# EAGLE schematic Ruggeduino (EAGLE 7.6.0)

## Sheet 1 of 4
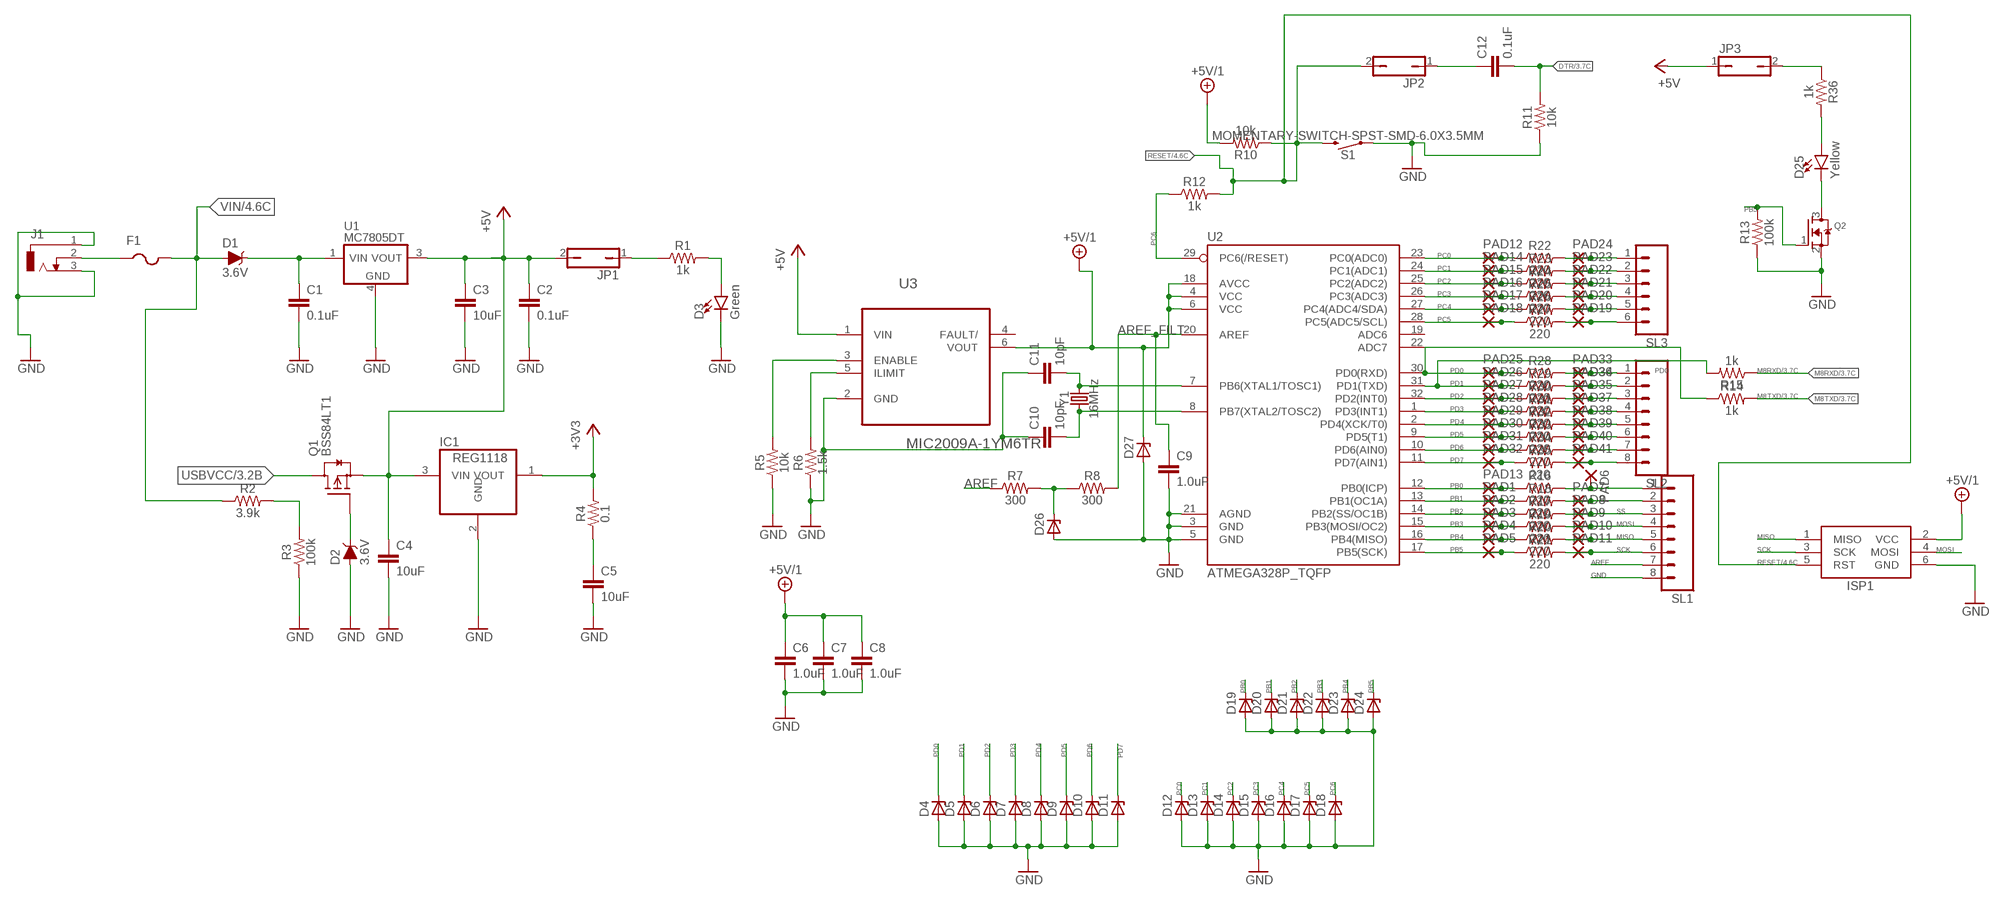
[diagram p0: schematic, sheet 1]

### Parts
C1  0.1uF  0.1UF-0603-25V-(+80/-20%)  [0603]
C2  0.1uF  0.1UF-0603-25V-(+80/-20%)  [0603]
C3  10uF  10UF-0603-6.3V-20%  [0603]
C4  10uF  10UF-0603-6.3V-20%  [0603]
C5  10uF  10UF-0603-6.3V-20%  [0603]
C6  1.0uF  1.0UF-0603-16V-10%  [0603]
C7  1.0uF  1.0UF-0603-16V-10%  [0603]
C8  1.0uF  1.0UF-0603-16V-10%  [0603]
C9  1.0uF  1.0UF-0603-16V-10%  [0603]
C10  10pF  10PF-0603-50V-5%  [0603]
C11  10pF  10PF-0603-50V-5%  [0603]
C12  0.1uF  0.1UF-0603-25V-(+80/-20%)  [0603]
D1  3.6V  DIODE-ZENER-BZT52C3V6S  [SOD-323]
D2  3.6V  DIODE-ZENER-BZT52C3V6S  [SOD-323]
D3  Green  LED-GREEN1206-BOTTOM  [LED-1206-BOTTOM]
D4  ZENER-DIODESOT23  [SOT23]
D5  ZENER-DIODESOT23  [SOT23]
D6  ZENER-DIODESOT23  [SOT23]
D7  ZENER-DIODESOT23  [SOT23]
D8  ZENER-DIODESOT23  [SOT23]
D9  ZENER-DIODESOT23  [SOT23]
D10  ZENER-DIODESOT23  [SOT23]
D11  ZENER-DIODESOT23  [SOT23]
D12  ZENER-DIODESOT23  [SOT23]
D13  ZENER-DIODESOT23  [SOT23]
D14  ZENER-DIODESOT23  [SOT23]
D15  ZENER-DIODESOT23  [SOT23]
D16  ZENER-DIODESOT23  [SOT23]
D17  ZENER-DIODESOT23  [SOT23]
D18  ZENER-DIODESOT23  [SOT23]
D19  ZENER-DIODESOT23  [SOT23]
D20  ZENER-DIODESOT23  [SOT23]
D21  ZENER-DIODESOT23  [SOT23]
D22  ZENER-DIODESOT23  [SOT23]
D23  ZENER-DIODESOT23  [SOT23]
D24  ZENER-DIODESOT23  [SOT23]
D25  Yellow  LED-YELLOW0603  [LED-0603]
D26  ZENER-DIODESOT23  [SOT23]
D27  ZENER-DIODESOT23  [SOT23]
F1  PTCFUSE-1206  [R1206]
IC1  REG1118  [SOT223]
ISP1  AVRISP-6  [AVRISP]
J1  DCJ0303  [DCJ0303]
JP1  JP1Q  [JP1]
JP2  JP1Q  [JP1]
JP3  JP1Q  [JP1]
PAD1  1,6/0,8  [1,6/0,8]
PAD2  1,6/0,8  [1,6/0,8]
PAD3  1,6/0,8  [1,6/0,8]
PAD4  1,6/0,8  [1,6/0,8]
PAD5  1,6/0,8  [1,6/0,8]
PAD6  1,6/0,8  [1,6/0,8]
PAD7  1,6/0,8  [1,6/0,8]
PAD8  1,6/0,8  [1,6/0,8]
PAD9  1,6/0,8  [1,6/0,8]
PAD10  1,6/0,8  [1,6/0,8]
PAD11  1,6/0,8  [1,6/0,8]
PAD12  1,6/0,8  [1,6/0,8]
PAD13  1,6/0,8  [1,6/0,8]
PAD14  1,6/0,8  [1,6/0,8]
PAD15  1,6/0,8  [1,6/0,8]
PAD16  1,6/0,8  [1,6/0,8]
PAD17  1,6/0,8  [1,6/0,8]
PAD18  1,6/0,8  [1,6/0,8]
PAD19  1,6/0,8  [1,6/0,8]
PAD20  1,6/0,8  [1,6/0,8]
PAD21  1,6/0,8  [1,6/0,8]
PAD22  1,6/0,8  [1,6/0,8]
PAD23  1,6/0,8  [1,6/0,8]
PAD24  1,6/0,8  [1,6/0,8]
PAD25  1,6/0,8  [1,6/0,8]
PAD26  1,6/0,8  [1,6/0,8]
PAD27  1,6/0,8  [1,6/0,8]
PAD28  1,6/0,8  [1,6/0,8]
PAD29  1,6/0,8  [1,6/0,8]
PAD30  1,6/0,8  [1,6/0,8]
PAD31  1,6/0,8  [1,6/0,8]
PAD32  1,6/0,8  [1,6/0,8]
PAD33  1,6/0,8  [1,6/0,8]
PAD34  1,6/0,8  [1,6/0,8]
PAD35  1,6/0,8  [1,6/0,8]
PAD36  1,6/0,8  [1,6/0,8]
PAD37  1,6/0,8  [1,6/0,8]
PAD38  1,6/0,8  [1,6/0,8]
PAD39  1,6/0,8  [1,6/0,8]
PAD40  1,6/0,8  [1,6/0,8]
PAD41  1,6/0,8  [1,6/0,8]
Q1  BSS84LT1  [SOT23]
Q2  MOSFET-NREFLOW  [SOT23]
R1  1k  1KOHM-0603-1/10W-1%  [0603]
R2  3.9k  3.9KOHM-0603-1/10W-1%  [0603]
R3  100k  100KOHM-0603-1/10W-1%  [0603]
R4  0.1  0.1OHM-1210-1/2W-1%  [1210]
R5  10k  10KOHM-0603-1/10W-1%  [0603]
R6  1.5k  1.5KOHM-0603-1/10W-1%  [0603]
R7  300  300OHM-0603-1/10W-1%  [0603]
R8  300  300OHM-0603-1/10W-1%  [0603]
R10  10k  10KOHM-0603-1/10W-1%  [0603]
R11  10k  10KOHM-0603-1/10W-1%  [0603]
R12  1k  1KOHM-0603-1/10W-1%  [0603]
R13  100k  100KOHM-0603-1/10W-1%  [0603]
R14  1k  1KOHM-0603-1/10W-1%  [0603]
R15  1k  1KOHM-0603-1/10W-1%  [0603]
R16  220  220OHM-0603-1/10W-1%  [0603]
R17  220  220OHM-0603-1/10W-1%  [0603]
R18  220  220OHM-0603-1/10W-1%  [0603]
R19  220  220OHM-0603-1/10W-1%  [0603]
R20  220  220OHM-0603-1/10W-1%  [0603]
R21  220  220OHM-0603-1/10W-1%  [0603]
R22  220  220OHM-0603-1/10W-1%  [0603]
R23  220  220OHM-0603-1/10W-1%  [0603]
R24  220  220OHM-0603-1/10W-1%  [0603]
R25  220  220OHM-0603-1/10W-1%  [0603]
R26  220  220OHM-0603-1/10W-1%  [0603]
R27  220  220OHM-0603-1/10W-1%  [0603]
R28  220  220OHM-0603-1/10W-1%  [0603]
R29  220  220OHM-0603-1/10W-1%  [0603]
R30  220  220OHM-0603-1/10W-1%  [0603]
R31  220  220OHM-0603-1/10W-1%  [0603]
R32  220  220OHM-0603-1/10W-1%  [0603]
R33  220  220OHM-0603-1/10W-1%  [0603]
R34  220  220OHM-0603-1/10W-1%  [0603]
R35  220  220OHM-0603-1/10W-1%  [0603]
R36  1k  1KOHM-0603-1/10W-1%  [0603]
S1  MOMENTARY-SWITCH-SPST-SMD-6.0X3.5MM  [TACTILE_SWITCH_SMD_6.0X3.5MM]
SL1  MA08  [08PA]
SL2  MA08  [08PA]
SL3  MA06  [06PA]
U1  MC7805DT  [DPAK-3]
U2  ATMEGA328P_TQFP  [TQFP32-08]
U3  MIC2009A-1YM6TR  [SOT95P280X145-6N]
Y1  16MHz  CRYSTAL-16MHZSMD-5X3.2  [CRYSTAL-SMD-5X3.2-4PAD]

### Nets
+3V3: IC1.1(VOUT) R4.2
+5V: C2.1 C3.1 C4.1 IC1.3(VIN) JP1.2 JP3.1 Q1.2(S) U1.3(VOUT) U3.1(VIN)
+5V/1: C6.1 C7.1 C8.1 D27.3(C) ISP1.2(VCC) R10.2 U2.4(VCC) U2.6(VCC) U2.18(AVCC) U3.6(VOUT)
AREF: R7.1 SL1.7
AREF_FILT: C9.1 R8.2 U2.20(AREF)
D0: PAD41.1(P) R35.2 SL2.8
DTR/3.7C: C12.2 R11.2
GND: C1.2 C2.2 C3.2 C4.2 C5.2 C6.2 C7.2 C8.2 C9.2 C10.1 C11.1 D2.A D3.C D4.1(A) D5.1(A) D6.1(A) D7.1(A) D8.1(A) D9.1(A) D10.1(A) D11.1(A) D12.1(A) D13.1(A) D14.1(A) D15.1(A) D16.1(A) D17.1(A) D18.1(A) D19.1(A) D20.1(A) D21.1(A) D22.1(A) D23.1(A) D24.1(A) D26.1(A) D27.1(A) IC1.2(GND) ISP1.6(GND) J1.1 J1.3 Q2.2(S) R3.1 R5.1 R6.1 R11.1 R13.1 S1.1 SL1.8 U1.4(GND) U2.3(GND) U2.5(GND) U2.21(AGND) U3.2(GND)
M8RXD/3.7C: R15.1
M8TXD/3.7C: R14.2
MISO: ISP1.1(MISO) PAD10.1(P) R20.2 SL1.5
MOSI: ISP1.4(MOSI) PAD9.1(P) R19.2 SL1.4
N$1: C5.1 R4.1
N$3: F1.1 J1.2
N$4: R6.2 U3.5(ILIMIT)
N$5: C1.1 D1.C U1.1(VIN)
N$6: JP1.1 R1.1
N$7: D3.A R1.2
N$8: R2.2 R3.2
N$9: R5.2 U3.3(ENABLE)
N$10: D2.C Q1.1(G)
N$11: C11.2 U2.7(PB6(XTAL1/TOSC1)) Y1.3
N$12: D26.3(C) R7.2 R8.1
N$13: C12.1 JP2.1
N$14: C10.2 U2.8(PB7(XTAL2/TOSC2)) Y1.1
N$15: JP3.2 R36.1
N$16: D25.A R36.2
N$17: D25.C Q2.3(D)
N$25: PAD6.1(P) R16.2 SL1.1
N$26: PAD7.1(P) R18.2 SL1.2
N$31: PAD24.1(P) R22.2 SL3.1
N$32: PAD23.1(P) R23.2 SL3.2
N$33: PAD22.1(P) R24.2 SL3.3
N$34: PAD21.1(P) R25.2 SL3.4
N$35: PAD20.1(P) R26.2 SL3.5
N$36: PAD19.1(P) R27.2 SL3.6
N$37: PAD34.1(P) PAD36.1(P) R29.2 SL2.2
N$47: PAD35.1(P) R30.2 SL2.3
N$48: PAD37.1(P) R31.2 SL2.4
N$49: PAD38.1(P) R32.2 SL2.5
N$50: PAD39.1(P) R33.2 SL2.6
N$51: PAD40.1(P) R34.2 SL2.7
PB0: D19.3(C) PAD13.1(P) R16.1 U2.12(PB0(ICP))
PB1: D20.3(C) PAD1.1(P) R18.1 U2.13(PB1(OC1A))
PB2: D21.3(C) PAD2.1(P) R17.1 U2.14(PB2(SS/OC1B))
PB3: D22.3(C) PAD3.1(P) R19.1 U2.15(PB3(MOSI/OC2))
PB4: D23.3(C) PAD4.1(P) R20.1 U2.16(PB4(MISO))
PB5: D24.3(C) PAD5.1(P) Q2.1(G) R13.2 R21.1 U2.17(PB5(SCK))
PC0: D12.3(C) PAD12.1(P) R22.1 U2.23(PC0(ADC0))
PC1: D13.3(C) PAD14.1(P) R23.1 U2.24(PC1(ADC1))
PC2: D14.3(C) PAD15.1(P) R24.1 U2.25(PC2(ADC2))
PC3: D15.3(C) PAD16.1(P) R25.1 U2.26(PC3(ADC3))
PC4: D16.3(C) PAD17.1(P) R26.1 U2.27(PC4(ADC4/SDA))
PC5: D17.3(C) PAD18.1(P) R27.1 U2.28(PC5(ADC5/SCL))
PC6: D18.3(C) R12.1 U2.29(PC6(/RESET))
PD0: D4.3(C) PAD25.1(P) PAD33.1(P) R14.1 R28.1 R28.2 SL2.1 U2.30(PD0(RXD))
PD1: D5.3(C) PAD26.1(P) R15.2 R29.1 U2.31(PD1(TXD))
PD2: D6.3(C) PAD27.1(P) R30.1 U2.32(PD2(INT0))
PD3: D7.3(C) PAD28.1(P) R31.1 U2.1(PD3(INT1))
PD4: D8.3(C) PAD29.1(P) R32.1 U2.2(PD4(XCK/T0))
PD5: D9.3(C) PAD30.1(P) R33.1 U2.9(PD5(T1))
PD6: D10.3(C) PAD31.1(P) R34.1 U2.10(PD6(AIN0))
PD7: D11.3(C) PAD32.1(P) R35.1 U2.11(PD7(AIN1))
RESET/4.6C: ISP1.5(RST) JP2.2 R10.1 R12.2 S1.2
SCK: ISP1.3(SCK) PAD11.1(P) R21.2 SL1.6
SS: PAD8.1(P) R17.2 SL1.3
USBVCC/3.2B: Q1.3(D)
VIN/4.6C: D1.A F1.2 R2.1
Unconnected: U2.19(ADC6) U2.22(ADC7) U3.4(FAULT/)

## Sheet 2 of 4
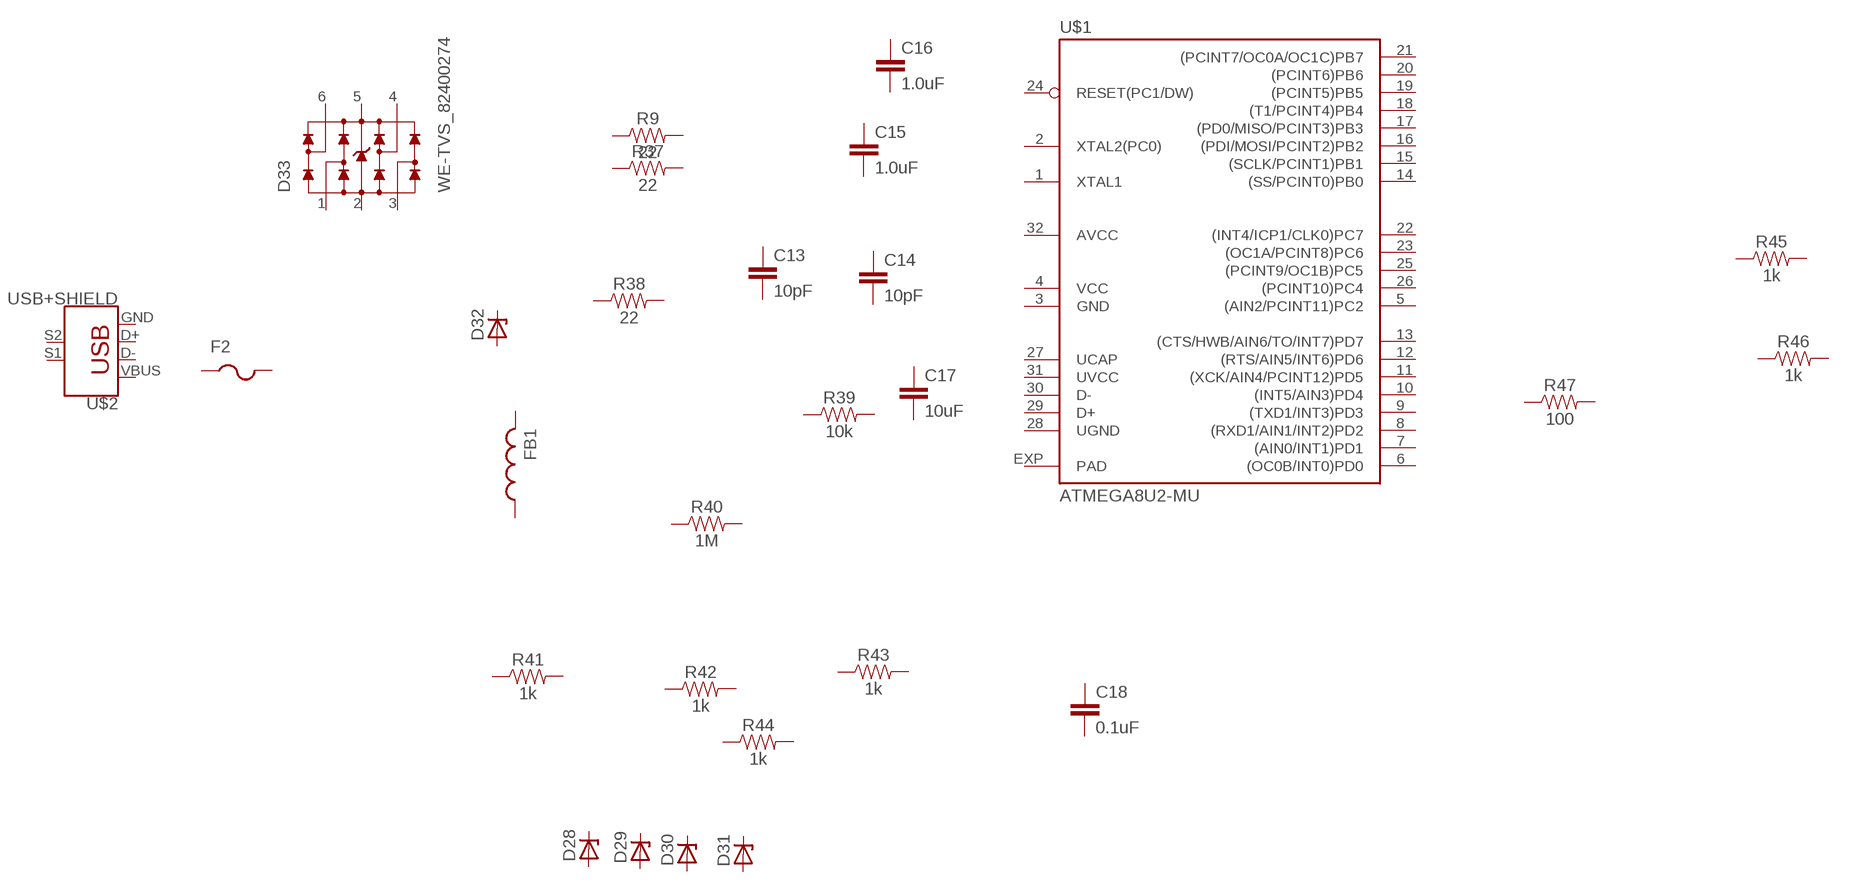
[diagram p1: schematic, sheet 2]

### Parts
C13  10pF  10PF-0603-50V-5%  [0603]
C14  10pF  10PF-0603-50V-5%  [0603]
C15  1.0uF  1.0UF-0603-16V-10%  [0603]
C16  1.0uF  1.0UF-0603-16V-10%  [0603]
C17  10uF  10UF-0603-6.3V-20%  [0603]
C18  0.1uF  0.1UF-0603-25V-(+80/-20%)  [0603]
D28  ZENER-DIODESOT23  [SOT23]
D29  ZENER-DIODESOT23  [SOT23]
D30  ZENER-DIODESOT23  [SOT23]
D31  ZENER-DIODESOT23  [SOT23]
D32  ZENER-DIODESOT23  [SOT23]
D33  WE-TVS_82400274  [WE-TVS_SC70-6L]
F2  PTCFUSE-1206  [R1206]
FB1  FERRITE-BEADA  [0603]
R9  22  22OHM-0603-1/10W-1%  [0603]
R37  22  22OHM-0603-1/10W-1%  [0603]
R38  22  22OHM-0603-1/10W-1%  [0603]
R39  10k  10KOHM-0603-1/10W-1%  [0603]
R40  1M  1MOHM-0603-1/4W-5%  [0603]
R41  1k  1KOHM-0603-1/10W-1%  [0603]
R42  1k  1KOHM-0603-1/10W-1%  [0603]
R43  1k  1KOHM-0603-1/10W-1%  [0603]
R44  1k  1KOHM-0603-1/10W-1%  [0603]
R45  1k  1KOHM-0603-1/10W-1%  [0603]
R46  1k  1KOHM-0603-1/10W-1%  [0603]
R47  100  100OHM-0603-1/4W-5%  [0603]
U$1  ATMEGA8U2-MU  [QFN32]
U$2  USB+SHIELD  [USB-B-PTH]
Unconnected: C13.1 C13.2 C14.1 C14.2 C15.1 C15.2 C16.1 C16.2 C17.1 C17.2 C18.1 C18.2 D28.1(A) D28.3(C) D29.1(A) D29.3(C) D30.1(A) D30.3(C) D31.1(A) D31.3(C) D32.1(A) D32.3(C) D33.1 D33.3 D33.4 D33.6 F2.1 F2.2 FB1.1 FB1.2 R9.1 R9.2 R37.1 R37.2 R38.1 R38.2 R39.1 R39.2 R40.1 R40.2 R41.1 R41.2 R42.1 R42.2 R43.1 R43.2 R44.1 R44.2 R45.1 R45.2 R46.1 R46.2 R47.1 R47.2 U$1.1(XTAL1) U$1.2(XTAL2(PC0)) U$1.5((AIN2/PCINT11)PC2) U$1.6((OC0B/INT0)PD0) U$1.7((AIN0/INT1)PD1) U$1.8((RXD1/AIN1/INT2)PD2) U$1.9((TXD1/INT3)PD3) U$1.10((INT5/AIN3)PD4) U$1.11((XCK/AIN4/PCINT12)PD5) U$1.12((RTS/AIN5/INT6)PD6) U$1.13((CTS/HWB/AIN6/TO/INT7)PD7) U$1.14((SS/PCINT0)PB0) U$1.15((SCLK/PCINT1)PB1) U$1.16((PDI/MOSI/PCINT2)PB2) U$1.17((PD0/MISO/PCINT3)PB3) U$1.18((T1/PCINT4)PB4) U$1.19((PCINT5)PB5) U$1.20((PCINT6)PB6) U$1.21((PCINT7/OC0A/OC1C)PB7) U$1.22((INT4/ICP1/CLK0)PC7) U$1.23((OC1A/PCINT8)PC6) U$1.24(RESET(PC1/DW)) U$1.25((PCINT9/OC1B)PC5) U$1.26((PCINT10)PC4) U$1.27(UCAP) U$1.29(D+) U$1.30(D-) U$2.D+ U$2.D- U$2.S1 U$2.S2

## Sheet 3 of 4

## Sheet 4 of 4

## Power pins joined to a net without a drawn wire
AVCC: U$1.32(AVCC)
GND: D33.2(GND) U$1.3(GND) U$2.GND
PAD: U$1.EXP(PAD)
UGND: U$1.28(UGND)
UVCC: U$1.31(UVCC)
VBUS: U$2.VBUS
VCC: U$1.4(VCC)
VDD: D33.5(VDD)

## Library data of the parts
C1 C2 C12 C18 = SparkFun-Capacitors:0.1UF: 0.1µF ceramic capacitors A capacitor is a passive two-terminal electrical component used to store electrical energy temporarily in an electric field.; PROD_ID: CAP-00810
C3-C5 C17 = SparkFun-Capacitors:10UF: 10.0µF ceramic capacitors A capacitor is a passive two-terminal electrical component used to store electrical energy temporarily in an electric field.; PROD_ID: CAP-11015
C6-C9 C15 C16 = SparkFun-Capacitors:1.0UF: 1µF ceramic capacitors A capacitor is a passive two-terminal electrical component used to store electrical energy temporarily in an electric field.; PROD_ID: CAP-00868
C10 C11 C13 C14 = SparkFun-Capacitors:10PF: 10pF ceramic capacitors A capacitor is a passive two-terminal electrical component used to store electrical energy temporarily in an electric field.; PROD_ID: CAP-11812
D1 D2 = SparkFun-DiscreteSemi:DIODE-ZENER: Zener Diode A Zener diode allows current to flow from its anode to its cathode like a normal semiconductor diode, but it also permits current to flow in the reverse direction when its "Zener voltage" is reached. - WIkipedia; PROD_ID: DIO-08199
D3 = SparkFun-LED:LED-GREEN: Green SMD LED Used in manufacturing of various products at SparkFun Packages: 0603 - SMD 0603 package [Product Link] <http://www.futureelectronics.com/en/technologies/semiconductors/optoelectronics/leds/Pages/9894312-LTST-C190GKT.aspx?CrossPart=HSMG-C190&IM=0> LilyPad 1206 - SMD1206 LilyPad package [Product Link] <http://www.futureelectronics.com/en/Technologies/Product.aspx?ProductID=IN150NGHARVATEKCORPORATION2049943&IM=0> 1206 - SMD1206 package [Product Link] <http://www.futureelectronics.com/en/technologies/semiconductors/optoelectronics/leds/Pages/8315665-LTST-C150KGKT.aspx?IM=0> 1206 Bottom Mount -SMD 1206 Bottom Mount [Product Link] <http://www.digikey.com/product-detail/en/lite-on-inc/LTST-C230KGKT/160-1456-1-ND/386854> SparkFun Products: Pro Mini 328 -5V <https://www.sparkfun.com/products/821> RedBoard <https://www.sparkfun.com/products/12757> MP3 Trigger <https://www.sparkfun.com/products/13720> Makey Makey <https://www.sparkfun.com/products/11076>; PROD_ID: DIO-11076
D4-D24 D26 D27 = diode:ZENER-DIODE: Z-Diode
D25 = SparkFun-LED:LED-YELLOW: Yellow SMD LED Used in manufacturing several products at SparkFun. Packages: 0603 - SMD 0603 package[Product Link] <http://www.kingbrightusa.com/product.asp?catalog_name=LED&product_id=APT1608SYCK> 0603 -SMART - SMART SMD 0603 package (more efficient/more expensive) [Product Link] <http://www.osram-os.com/osram_os/en/products/product-catalog/led-light-emitting-diodes/smartled-0603/ly-l29k/index.jsp> LilyPad - SMD1206 package[Product Datasheet] <https://www.sparkfun.com/datasheets/DevTools/LilyPad/Q150YUS4.pdf> SparkFun Products: Blynk Board <https://www.sparkfun.com/products/13794> IOIO-OTG <https://www.sparkfun.com/products/13613> XBee Explorer Serial <https://www.sparkfun.com/products/13225>; PROD_ID: DIO-09003
D28-D32 = diode-1:ZENER-DIODE: Z-Diode
D33 = Wurth_Elektronik_Passive_rev15c:WE-TVS_82400274: TVS Diode High Speed Series Characteristics Low clamping voltage Sturdy design Very low capacitance Flow Thru Design for a simple layout Rail to Rail protection Epoxy flame resistant UL94 V-0 RoHS, REACH and free of halogens Applications Very fast data lines USB 2.0 Ethernet PoE VGA Sim Cards Keypads ESD protection in accordance with EN 61000-4-2, – 8 kV contact discharge – 15 kV air discharge <http://katalog.we-online.de/media/images/eisos/VarTVS_highspeed_pf2.jpg.jpg> Details see: http://katalog.we-online.de/en/pbs/WE-TVS_High_Speed/824001? Updated by Dan Xu 2014-07-11 2014 (C) Wurth Elektronik
F1 F2 = adafruit:PTCFUSE: PTC fuses, resettable thermistors
FB1 = m-pad-2.1:FERRITE-BEAD: Ferrite beads in various packages
IC1 = burr-brown:REG1118: 800mA Low Dropout (LDO) Positive Regulator with Current Source and Sink Capability; MPN: REG1118-2.85/2K5G4; OC_FARNELL: unknown; OC_NEWARK: 14M2185
ISP1 = adafruit:AVRISP: AVR ISP HEADER Standard 6 pin header for AVR programming
J1 = con-jack:DCJ0303: DC POWER JACK Source: DCJ0303.pdf; OC_FARNELL: unknown; OC_NEWARK: unknown
JP1-JP3 = jumper:JP1Q: JUMPER
PAD1-PAD41 = wirepad:1,6/0,8: THROUGH-HOLE PAD
Q1 = m-pad-2.1:BSS84LT1: OnSemi's BSS84LT1 Power MOSFET 130 mA, 50 V RDS(on) = 10 P-Channel SOT-23 Description: These miniature surface mount MOSFETs reduce power loss conserve energy, making this device ideal for use in small power management circuitry. Typical applications are DC/DC converters, load switching, power management in portable and battery-powered products such as computers, printers, cellular and cordless telephones. Features: Energy Efficient Miniature SOT-23 Surface Mount Package Saves Board Space Pb-Free Package is Available Please send any comments to: messi@users.sourceforge.net
Q2 = adafruit:MOSFET-N: N-Channel Mosfet 2N7002E - 60V 260mA SOT23 [Digikey: 2N7002ET1GOSTR-ND] - REEL BSH103 - 30V 850mA SOT23 [Digikey: 568-5013-1-ND]
R1 R12 R14 R15 R36 R41-R46 = SparkFun-Resistors:1KOHM: 1kΩ resistor A resistor is a passive two-terminal electrical component that implements electrical resistance as a circuit element. Resistors act to reduce current flow, and, at the same time, act to lower voltage levels within circuits. - Wikipedia; PROD_ID: RES-07856
R2 = SparkFun-Resistors:3.9KOHM: 3.9kΩ resistor A resistor is a passive two-terminal electrical component that implements electrical resistance as a circuit element. Resistors act to reduce current flow, and, at the same time, act to lower voltage levels within circuits. - Wikipedia; PROD_ID: RES-08701
R3 R13 = SparkFun-Resistors:100KOHM: 100kΩ resistor A resistor is a passive two-terminal electrical component that implements electrical resistance as a circuit element. Resistors act to reduce current flow, and, at the same time, act to lower voltage levels within circuits. - Wikipedia; PROD_ID: RES-07828
R4 = SparkFun-Resistors:0.1OHM: 0.1Ω resistor A resistor is a passive two-terminal electrical component that implements electrical resistance as a circuit element. Resistors act to reduce current flow, and, at the same time, act to lower voltage levels within circuits. - Wikipedia; PROD_ID: RES-12374
R5 R10 R11 R39 = SparkFun-Resistors:10KOHM: 10kΩ resistor A resistor is a passive two-terminal electrical component that implements electrical resistance as a circuit element. Resistors act to reduce current flow, and, at the same time, act to lower voltage levels within circuits. - Wikipedia; PROD_ID: RES-00824
R6 = SparkFun-Resistors:1.5KOHM: 1.5kΩ resistor A resistor is a passive two-terminal electrical component that implements electrical resistance as a circuit element. Resistors act to reduce current flow, and, at the same time, act to lower voltage levels within circuits. - Wikipedia; PROD_ID: RES-08306
R7 R8 = SparkFun-Resistors:300OHM: 300Ω resistor A resistor is a passive two-terminal electrical component that implements electrical resistance as a circuit element. Resistors act to reduce current flow, and, at the same time, act to lower voltage levels within circuits. - Wikipedia; PROD_ID: RES_10328
R9 R37 R38 = SparkFun-Resistors:22OHM: 22Ω resistor A resistor is a passive two-terminal electrical component that implements electrical resistance as a circuit element. Resistors act to reduce current flow, and, at the same time, act to lower voltage levels within circuits. - Wikipedia; PROD_ID: RES-08698
R16-R35 = SparkFun-Resistors:220OHM: 220Ω resistor A resistor is a passive two-terminal electrical component that implements electrical resistance as a circuit element. Resistors act to reduce current flow, and, at the same time, act to lower voltage levels within circuits. - Wikipedia; PROD_ID: RES-07861
R40 = SparkFun-Resistors:1MOHM: 1MΩ resistor A resistor is a passive two-terminal electrical component that implements electrical resistance as a circuit element. Resistors act to reduce current flow, and, at the same time, act to lower voltage levels within circuits. - Wikipedia; PROD_ID: RES-07868
R47 = SparkFun-Resistors:100OHM: 100Ω resistor A resistor is a passive two-terminal electrical component that implements electrical resistance as a circuit element. Resistors act to reduce current flow, and, at the same time, act to lower voltage levels within circuits. - Wikipedia; PROD_ID: RES-12438
S1 = SparkFun-Switches:MOMENTARY-SWITCH-SPST: Momentary Switch (Pushbutton) - SPST Normally-open (NO) SPST momentary switches (buttons, pushbuttons). Variants PTH-12MM - 12mm square, through-hole Momentary Pushbutton Switch - 12mm Square <https://www.sparkfun.com/products/9190> (COM-09190) PTH-6.0MM, PTH-6.0MM-KIT - 6.0mm square, through-hole Mini Pushbutton Switch <https://www.sparkfun.com/products/97> (COM-00097) KIT package intended for soldering kit's - only one side of pads' copper is exposed. PTH-RIGHT-ANGLE-KIT - Right-angle, through-hole Right Angle Tactile Button <https://www.sparkfun.com/products/10791> - Used on SparkFun BigTime Watch Kit <https://www.sparkfun.com/products/11734> SMD-12MM - 12mm square, surface-mount Tactile Button - SMD (12mm) <https://www.sparkfun.com/products/12993> (COM-12993) Used on SparkFun PicoBoard <https://www.sparkfun.com/products/11888> SMD-4.5MM - 4.5mm Square Trackball Switch Used on SparkFun Blackberry Trackballer Breakout <https://www.sparkfun.com/products/13169> SMD-4.6MMX2.8MM - 4.60mm x 2.80mm, surface mount Used on SparkFun SAMD21 Mini Breakout <https://www.sparkfun.com/products/13664> SMD-5.2MM, SMD-5.2-REDUNDANT - 5.2mm square, surface-mount Mini Pushbutton Switch - SMD <https://www.sparkfun.com/products/8720> (COM-08720) Used on Arduino Pro Mini <https://www.sparkfun.com/products/11114> REDUNDANT package connects both switch circuits together SMD-6.0X3.5MM - 6.0 x 3.5mm, surface mount Momentary Reset Switch SMD <https://www.sparkfun.com/products/8229> (COM-08229) SMD-6.2MM-TALL - 6.2mm square, surface mount Tactile Button - SMD (6mm) <https://www.sparkfun.com/products/12992> Used on SparkFun Digital Sandbox <https://www.sparkfun.com/products/12651> SMD-RIGHT-ANGLE - Right-angle, surface mount Used on SparkFun Block for Intel® Edison - Arduino <https://www.sparkfun.com/products/13036>; PROD_ID: SWCH-00815; SF_SKU: COM-08229
SL1 SL2 = con-amp-quick:MA08: AMP QUICK CONNECTOR; OC_FARNELL: unknown; OC_NEWARK: unknown
SL3 = con-amp-quick:MA06: AMP QUICK CONNECTOR; OC_FARNELL: unknown; OC_NEWARK: unknown
U1 = _hhn_78xx_79xx_NCV78xx_d2pak_dpak:MC78*: 78xx SMD (D2PAK, DPAK) (MC)78xx..DT (DPAK-3; Rth,JA = 92 K/W) (MC)78xx..D2T (D2PAK-3; Rth,JA = 45 K/W @ 10x10mm copper area) Linear Voltage Regulators, Positive, 1 A (ON Semiconductor) Package dimenisions and soldering footprints acc. to ONSEMI specs. Source: http://onsemi.com Datasheet document#: MC7800/D Technologies: 78xxyD(2)Tz: xx = Output Voltage (V) y, z: additional suffixes see manufacturer's datasheet Author: Dipl.-Ing. FH Rainer Bayer HHN Hochschule Heilbronn, rainer.bayer@hs-heilbronn.de Ingenieurbüro ing-rb, mail@ing-rb.de
U2 = SparkFun-IC-Microcontroller:ATMEGA328P_TQFP: Popular 328P in QFP Storefront component: ATmega328 - TQFP <https://www.sparkfun.com/products/13448> (COM-13448) Datasheet <http://www.sparkfun.com/datasheets/Components/SMD/ATMega328.pdf> SparkFun Products SparkFun RedBoard - Programmed with Arduino <https://www.sparkfun.com/products/12757> (DEV-12757) Arduino Pro Mini 328 - 5V/16MHz <https://www.sparkfun.com/products/11113> (DEV-11113) Arduino Pro Mini 328 - 3.3V/8MHz <https://www.sparkfun.com/products/11114> (DEV-11114) SparkFun OpenLog <https://www.sparkfun.com/products/13712> (DEV-13712) SparkFun MicroView - OLED Arduino Module <https://www.sparkfun.com/products/12923> (DEV-12923) SparkFun Digital Sandbox <https://www.sparkfun.com/products/12651> (DEV-12651) SparkFun PicoBoard <https://www.sparkfun.com/products/11888> (WIG-11888) Arduino Fio <https://www.sparkfun.com/products/10116> (DEV-10116) LilyPad Arduino 328 Main Board <https://www.sparkfun.com/products/13342> (DEV-13342) SparkFun RedStick <https://www.sparkfun.com/products/13741> (DEV-13741) LilyPad MP3 <https://www.sparkfun.com/products/11013> (DEV-11013) LilyPad Arduino SimpleSnap <https://www.sparkfun.com/products/10941> (DEV-10941) SparkFun Stepoko <https://www.sparkfun.com/products/13899> (ROB-13899) SparkFun Geiger Counter <https://www.sparkfun.com/products/11345> (SEN-11345) SparkFun EL Sequencer <https://www.sparkfun.com/products/12781> (COM-12781) Arduino Pro 328 - 5V/16MHz <https://www.sparkfun.com/products/10915> (DEV-10915) CryptoCape <https://www.sparkfun.com/products/12773> (DEV-12773) SparkFun IR Thermometer Evaluation Board - MLX90614 <https://www.sparkfun.com/products/10740> (SEN-10740) SparkFun RedBot Mainboard <https://www.sparkfun.com/products/12097> (ROB-12097) Arduino Pro 328 - 3.3V/8MHz <https://www.sparkfun.com/products/10914> (DEV-10914) SparkFun Block for Intel® Edison - Arduino <https://www.sparkfun.com/products/13036> (DEV-13036) SparkFun Simon Says - Surface Mount Soldering Kit <https://www.sparkfun.com/products/10935> (KIT-10935) SparkFun 7-Segment Serial Display - Red <https://www.sparkfun.com/products/11441> (COM-11441) SparkFun 7-Segment Serial Display - White <https://www.sparkfun.com/products/11629> (COM-11629) SparkFun 7-Segment Serial Display - Yellow <https://www.sparkfun.com/products/11443> (COM-11443) SparkFun 7-Segment Serial Display - Kelly Green <https://www.sparkfun.com/products/11440> (COM-11440) SparkFun 7-Segment Serial Display - Blue <https://www.sparkfun.com/products/11442> (COM-11442) SparkFun OpenSegment Serial Display - 20mm (Blue) <https://www.sparkfun.com/products/11647> (COM-11647) SparkFun OpenSegment Serial Display - 20mm (Green) <https://www.sparkfun.com/products/11646> (COM-11646) SparkFun OpenSegment Serial Display - 20mm (White) <https://www.sparkfun.com/products/11648> (COM-11648) SparkFun OpenSegment Serial Display - 20mm (Red) <https://www.sparkfun.com/products/11644> (COM-11644) SparkFun OpenSegment Serial Display - 20mm (Yellow) <https://www.sparkfun.com/products/11645> (COM-11645) SparkFun OpenSegment Shield <https://www.sparkfun.com/products/13190> (DEV-13190); PROD_ID: IC-09069
U3 = Ava:MIC2009A-1YM6TR: Fixed and adjustable Current Limiting Power Distribution Switches; MPN: MIC2009A-1YM6TR; OC_FARNELL: 1924703; OC_NEWARK: 58T4892; PACKAGE: SOT-23-6; SUPPLIER: MICREL SEMICONDUCTOR
U$1 = ATMEGA8U2-MU:ATMEGA8U2-MU; AVAILABILITY: Good; DESCRIPTION: ATmega Series 16 MHz 8 KB Flash 512 B SRAM 8-Bit Microcontroller - QFN-32; MF: Microchip; MP: ATMEGA8U2-MU; PACKAGE: VQFN-32 Microchip; PRICE: 2.30 USD
U$2 = SparkFun-Retired:USB+SHIELD: USB+Shield USB connector with shield pins connectable
Y1 = SparkFun-Clocks:CRYSTAL-16MHZ: 16MHz Crystal Digikey Example <http://www.digikey.com/product-search/en?keywords=535-9122-1-ND> Frequency: 16MHz Frequency Stability: ±50ppm Frequency Tolerance: ±20ppm Load Capacitance: 18pF SparkFun Products: Pro Micro -5V/16MHz <https://www.sparkfun.com/products/12640> SparkFun Serial Enabled LCD Kit <https://www.sparkfun.com/products/10097>; PROD_ID: XTAL-08218; SF_ID: COM-00094